# Altium schematic sheet PIN_Gamma.SchDoc
size A; SheetNumber: 2; SheetTotal: 3
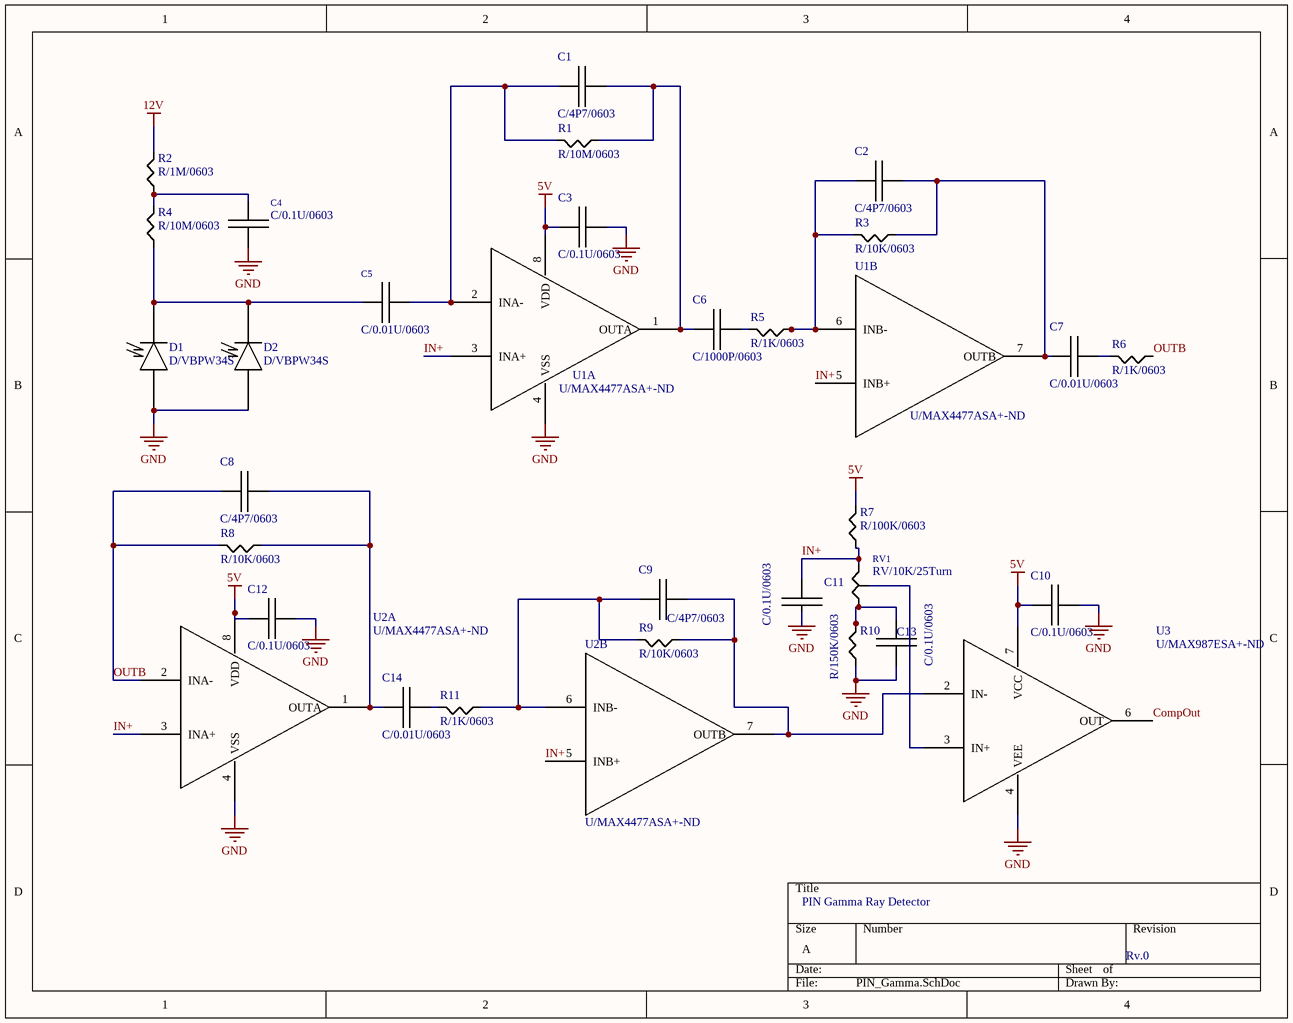
[diagram p0: PIN_Gamma.SchDoc]

## Parts
C1  C/4P7/0603  [C/0603]
C2  C/4P7/0603  [C/0603]
C3  C/0.1U/0603  [C/0603]
C4  C/0.1U/0603  [C/0603]
C5  C/0.01U/0603  [C/0603]
C6  C/1000P/0603  [C/0603]
C7  C/0.01U/0603  [C/0603]
C8  C/4P7/0603  [C/0603]
C9  C/4P7/0603  [C/0603]
C10  C/0.1U/0603  [C/0603]
C11  C/0.1U/0603  [C/0603]
C12  C/0.1U/0603  [C/0603]
C13  C/0.1U/0603  [C/0603]
C14  C/0.01U/0603  [C/0603]
D1  D/VBPW34S  [VBPW34S]
D2  D/VBPW34S  [VBPW34S]
R1  R/10M/0603  [R/0603]
R2  R/1M/0603  [R/0603]
R3  R/10K/0603  [R/0603]
R4  R/10M/0603  [R/0603]
R5  R/1K/0603  [R/0603]
R6  R/1K/0603  [R/0603]
R7  R/100K/0603  [R/0603]
R8  R/10K/0603  [R/0603]
R9  R/10K/0603  [R/0603]
R10  R/150K/0603  [R/0603]
R11  R/1K/0603  [R/0603]
RV1  RV/10K/25Turn  [10K/25TN]
U1  U/MAX4477ASA+-ND  [SO8]  (parts A,B of 2)
U2  U/MAX4477ASA+-ND  [SO8]  (parts A,B of 2)
U3  U/MAX987ESA+-ND  [SO8]

## Nets
5V: C3.1 C10.1 C12.1 R7.1 U1.8(VDD) U2.8(VDD) U3.7(VCC)
12V: R2.1
GND: C3.2 C4.2 C10.2 C11.2 C12.2 C13.2 D1.A D2.A R10.2 U1.4(VSS) U2.4(VSS) U3.4(VEE)
CompOut: U3.6(OUT)
IN+: C11.1 R7.2 RV1.1 U1.3(INA+) U1.5(INB+) U2.3(INA+) U2.5(INB+)
OUTB: C8.1 R6.2 R8.1 U2.2(INA-)
NetC1_1: C1.1 C5.2 R1.1 U1.2(INA-)
NetC1_2: C1.2 C6.1 R1.2 U1.1(OUTA)
NetC2_1: C2.1 R3.1 R5.2 U1.6(INB-)
NetC2_2: C2.2 C7.1 R3.2 U1.7(OUTB)
NetC4_1: C4.1 R2.2 R4.1
NetC5_1: C5.1 D1.K D2.K R4.2
NetC6_2: C6.2 R5.1
NetC7_2: C7.2 R6.1
NetC8_2: C8.2 C14.1 R8.2 U2.1(OUTA)
NetC9_1: C9.1 R9.1 R11.2 U2.6(INB-)
NetC9_2: C9.2 R9.2 U2.7(OUTB) U3.2(IN-)
NetC13_1: C13.1 R10.1 RV1.3
NetC14_2: C14.2 R11.1
NetRV1_2: RV1.2 U3.3(IN+)

Not connected (* = marked no-connect by the designer): U3 1(NC) 5(NC) 8(NC)

## Notes on the sheet
- PIN Gamma Ray Detector
- Rv.0

## Library data of the parts
C1 C2 C8 C9 = C/4P7/0603: CAP CER 4.7PF 50V C0G/NPO 0603; Digikey: 311-1740-1-ND
C3 C4 C10-C13 = C/0.1U/0603: CAP CER 0.1UF 50V X7R 0603; Digikey Part: 399-7845-1-ND
C5 C7 C14 = C/0.01U/0603: CAP CER 0.01UF 50V X7R 0603; Digikey Part: 399-1091-1-ND
C6 = C/1000P/0603: CAP CER 1000PF 50V C0G/NP0 0603; Digikey: 1276-1091-1-ND
D1 D2 = D/VBPW34S: PHOTODIODE PIN HI SPEED HI SENS
R1 R4 = R/10M/0603: RES SMD 10M OHM 5% 1/10W 0603; Digikey Part: RMCF0603JT10M0CT-ND
R2 = R/1M/0603: RES SMD 1M OHM 0.1% 1/16W 0603; Digikey Part: A119955CT-ND
R3 R8 R9 = R/10K/0603: RES SMD 10K OHM 5% 1/10W 0603; Digikey Part: 311-10KGRCT-ND
R5 R6 R11 = R/1K/0603: RES SMD 1K OHM 5% 1/10W 0603; Digikey Part: 311-1.0KGRCT-ND
R7 = R/100K/0603: RES SMD 100K OHM 1% 1/10W 0603; Digikey Part: 311-100KHRCT-ND
R10 = R/150K/0603: RES SMD 150K OHM 1% 1/10W 0603; Digikey Part: 311-150KGRDKR-ND
RV1 = RV/10K/25Turn: TRIMMER 10K OHM 0.5W TH; Digikey Part: A105870-ND
U1 U2 = U/MAX4477ASA+-ND: Dual Low-Noise, Low-Distortion, Wide-Band, Rail-to-Rail Op Amps
U3 = U/MAX987ESA+-ND: Comparator General Purpose CMOS, Push-Pull, Rail-to-Rail, TTL 8-SO